# EAGLE design 8x8 LED Cathode Base V4 (EAGLE 6.1)
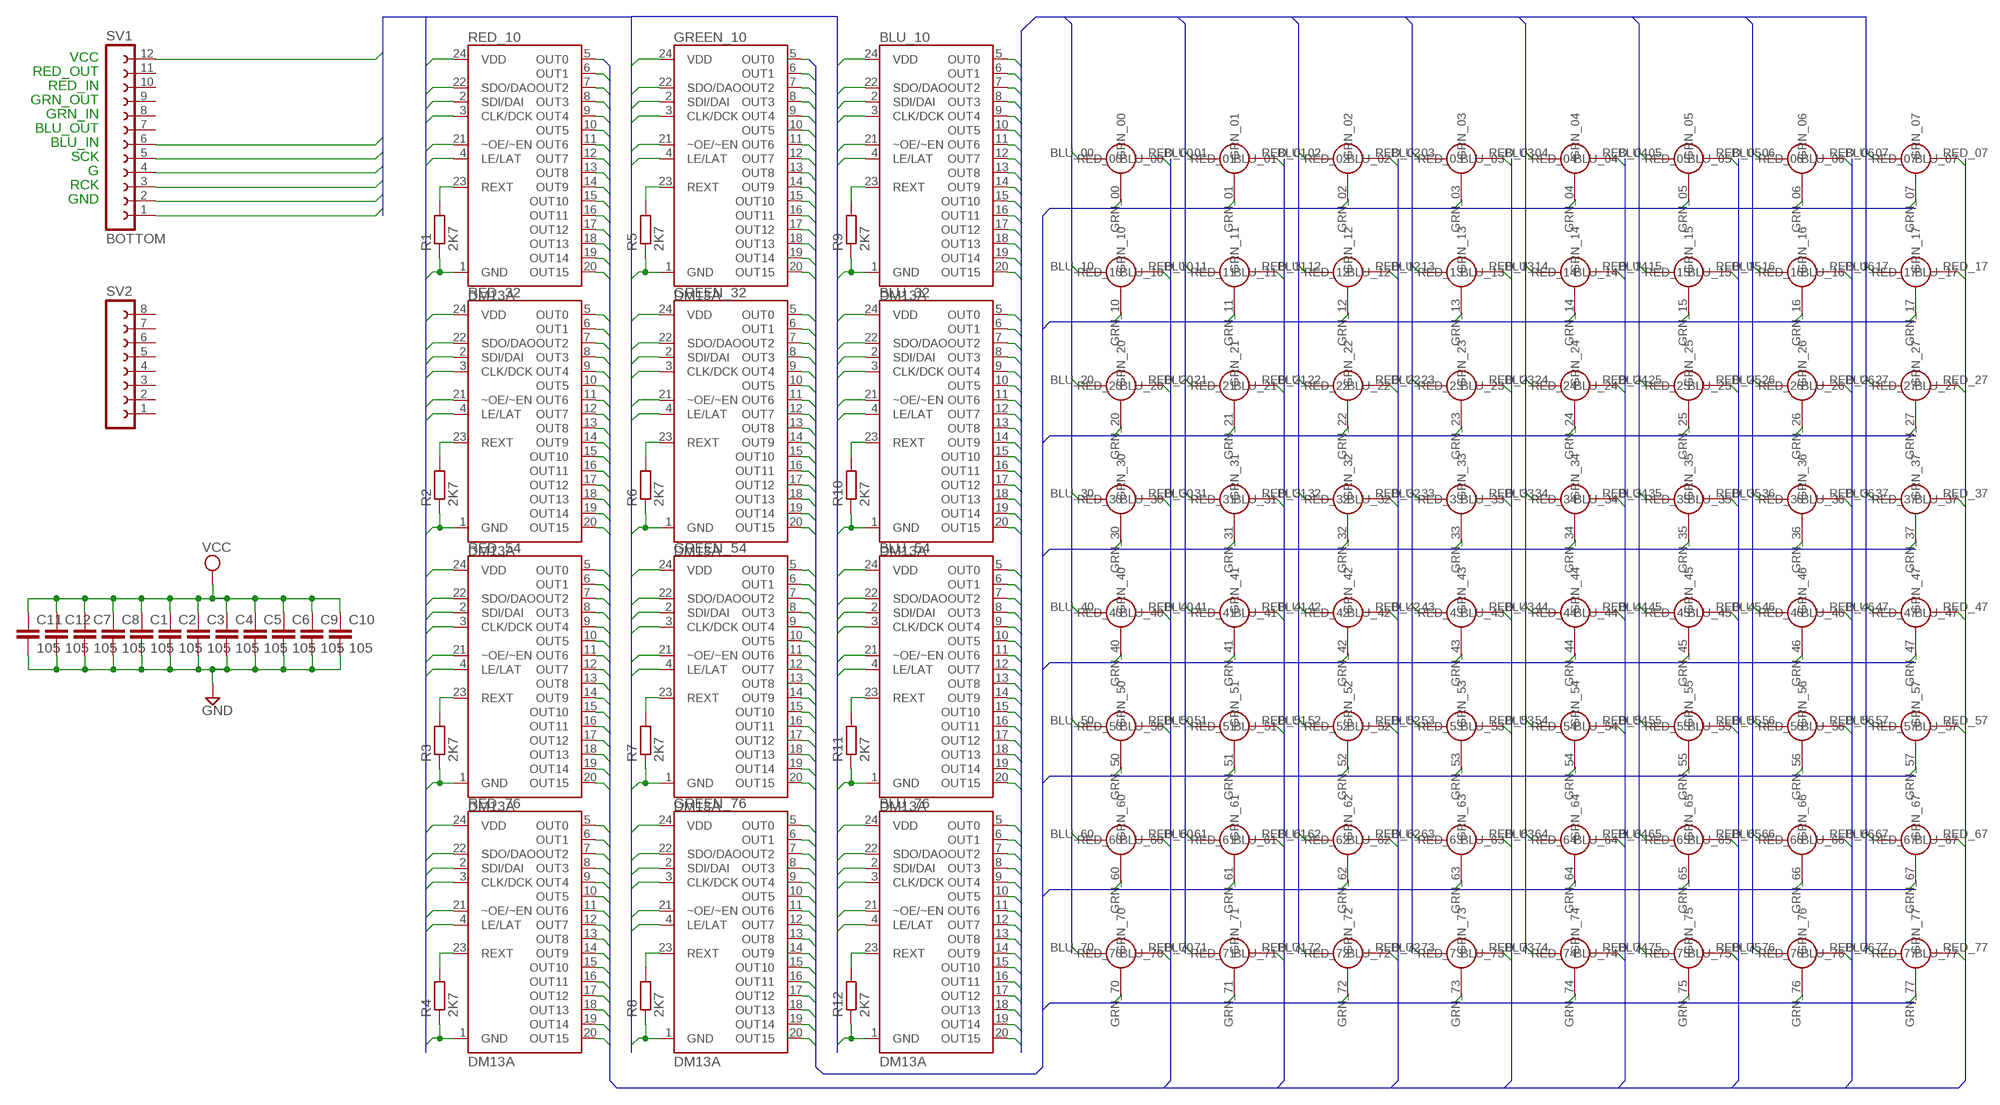
[diagram p0: schematic, sheet 1]

## Parts
BLU_10  DM13A  [DIL24-3]
BLU_32  DM13A  [DIL24-3]
BLU_54  DM13A  [DIL24-3]
BLU_76  DM13A  [DIL24-3]
C1  105  C-EUC1206  [C1206]
C2  105  C-EUC1206  [C1206]
C3  105  C-EUC1206  [C1206]
C4  105  C-EUC1206  [C1206]
C5  105  C-EUC1206  [C1206]
C6  105  C-EUC1206  [C1206]
C7  105  C-EUC1206  [C1206]
C8  105  C-EUC1206  [C1206]
C9  105  C-EUC1206  [C1206]
C10  105  C-EUC1206  [C1206]
C11  105  C-EUC1206  [C1206]
C12  105  C-EUC1206  [C1206]
GREEN_10  DM13A  [DIL24-3]
GREEN_32  DM13A  [DIL24-3]
GREEN_54  DM13A  [DIL24-3]
GREEN_76  DM13A  [DIL24-3]
R1  2K7  R-EU_R1206  [R1206]
R2  2K7  R-EU_R1206  [R1206]
R3  2K7  R-EU_R1206  [R1206]
R4  2K7  R-EU_R1206  [R1206]
R5  2K7  R-EU_R1206  [R1206]
R6  2K7  R-EU_R1206  [R1206]
R7  2K7  R-EU_R1206  [R1206]
R8  2K7  R-EU_R1206  [R1206]
R9  2K7  R-EU_R1206  [R1206]
R10  2K7  R-EU_R1206  [R1206]
R11  2K7  R-EU_R1206  [R1206]
R12  2K7  R-EU_R1206  [R1206]
RED_10  DM13A  [DIL24-3]
RED_32  DM13A  [DIL24-3]
RED_54  DM13A  [DIL24-3]
RED_76  DM13A  [DIL24-3]
SV1  BOTTOM  FE12-1  [FE12]
SV2  FE08-1  [FE08]
U$1  8X8_RGB_COLUMN  [8X8_RGB_LED_120]

## Nets
BLANK: BLU_10.21(~OE/~EN) BLU_32.21(~OE/~EN) BLU_54.21(~OE/~EN) BLU_76.21(~OE/~EN) GREEN_10.21(~OE/~EN) GREEN_32.21(~OE/~EN) GREEN_54.21(~OE/~EN) GREEN_76.21(~OE/~EN) RED_10.21(~OE/~EN) RED_32.21(~OE/~EN) RED_54.21(~OE/~EN) RED_76.21(~OE/~EN) SV1.4
BLU_00: BLU_10.5(OUT0) U$1.BLU_00
BLU_01: BLU_10.6(OUT1) U$1.BLU_01
BLU_02: BLU_10.7(OUT2) U$1.BLU_02
BLU_03: BLU_10.8(OUT3) U$1.BLU_03
BLU_04: BLU_10.9(OUT4) U$1.BLU_04
BLU_05: BLU_10.10(OUT5) U$1.BLU_05
BLU_06: BLU_10.11(OUT6) U$1.BLU_06
BLU_07: BLU_10.12(OUT7) U$1.BLU_07
BLU_10: BLU_10.13(OUT8) U$1.BLU_10
BLU_11: BLU_10.14(OUT9) U$1.BLU_11
BLU_12: BLU_10.15(OUT10) U$1.BLU_12
BLU_13: BLU_10.16(OUT11) U$1.BLU_13
BLU_14: BLU_10.17(OUT12) U$1.BLU_14
BLU_15: BLU_10.18(OUT13) U$1.BLU_15
BLU_16: BLU_10.19(OUT14) U$1.BLU_16
BLU_17: BLU_10.20(OUT15) U$1.BLU_17
BLU_20: BLU_32.5(OUT0) U$1.BLU_20
BLU_21: BLU_32.6(OUT1) U$1.BLU_21
BLU_22: BLU_32.7(OUT2) U$1.BLU_22
BLU_23: BLU_32.8(OUT3) U$1.BLU_23
BLU_24: BLU_32.9(OUT4) U$1.BLU_24
BLU_25: BLU_32.10(OUT5) U$1.BLU_25
BLU_26: BLU_32.11(OUT6) U$1.BLU_26
BLU_27: BLU_32.12(OUT7) U$1.BLU_27
BLU_30: BLU_32.13(OUT8) U$1.BLU_30
BLU_31: BLU_32.14(OUT9) U$1.BLU_31
BLU_32: BLU_32.15(OUT10) U$1.BLU_32
BLU_32_DATA: BLU_10.22(SDO/DAO) BLU_32.2(SDI/DAI)
BLU_33: BLU_32.16(OUT11) U$1.BLU_33
BLU_34: BLU_32.17(OUT12) U$1.BLU_34
BLU_35: BLU_32.18(OUT13) U$1.BLU_35
BLU_36: BLU_32.19(OUT14) U$1.BLU_36
BLU_37: BLU_32.20(OUT15) U$1.BLU_37
BLU_40: BLU_54.5(OUT0) U$1.BLU_40
BLU_41: BLU_54.6(OUT1) U$1.BLU_41
BLU_42: BLU_54.7(OUT2) U$1.BLU_42
BLU_43: BLU_54.8(OUT3) U$1.BLU_43
BLU_44: BLU_54.9(OUT4) U$1.BLU_44
BLU_45: BLU_54.10(OUT5) U$1.BLU_45
BLU_46: BLU_54.11(OUT6) U$1.BLU_46
BLU_47: BLU_54.12(OUT7) U$1.BLU_47
BLU_50: BLU_54.13(OUT8) U$1.BLU_50
BLU_51: BLU_54.14(OUT9) U$1.BLU_51
BLU_52: BLU_54.15(OUT10) U$1.BLU_52
BLU_53: BLU_54.16(OUT11) U$1.BLU_53
BLU_54: BLU_54.17(OUT12) U$1.BLU_54
BLU_54_DATA: BLU_32.22(SDO/DAO) BLU_54.2(SDI/DAI)
BLU_55: BLU_54.18(OUT13) U$1.BLU_55
BLU_56: BLU_54.19(OUT14) U$1.BLU_56
BLU_57: BLU_54.20(OUT15) U$1.BLU_57
BLU_60: BLU_76.5(OUT0) U$1.BLU_60
BLU_61: BLU_76.6(OUT1) U$1.BLU_61
BLU_62: BLU_76.7(OUT2) U$1.BLU_62
BLU_63: BLU_76.8(OUT3) U$1.BLU_63
BLU_64: BLU_76.9(OUT4) U$1.BLU_64
BLU_65: BLU_76.10(OUT5) U$1.BLU_65
BLU_66: BLU_76.11(OUT6) U$1.BLU_66
BLU_67: BLU_76.12(OUT7) U$1.BLU_67
BLU_70: BLU_76.13(OUT8) U$1.BLU_70
BLU_71: BLU_76.14(OUT9) U$1.BLU_71
BLU_72: BLU_76.15(OUT10) U$1.BLU_72
BLU_73: BLU_76.16(OUT11) U$1.BLU_73
BLU_74: BLU_76.17(OUT12) U$1.BLU_74
BLU_75: BLU_76.18(OUT13) U$1.BLU_75
BLU_76: BLU_76.19(OUT14) U$1.BLU_76
BLU_76_DATA: BLU_54.22(SDO/DAO) BLU_76.2(SDI/DAI)
BLU_77: BLU_76.20(OUT15) U$1.BLU_77
BLU_IN: BLU_10.2(SDI/DAI) SV1.6
BLU_OUT: BLU_76.22(SDO/DAO) GREEN_10.2(SDI/DAI)
CLOCK: BLU_10.3(CLK/DCK) BLU_32.3(CLK/DCK) BLU_54.3(CLK/DCK) BLU_76.3(CLK/DCK) GREEN_10.3(CLK/DCK) GREEN_32.3(CLK/DCK) GREEN_54.3(CLK/DCK) GREEN_76.3(CLK/DCK) RED_10.3(CLK/DCK) RED_32.3(CLK/DCK) RED_54.3(CLK/DCK) RED_76.3(CLK/DCK) SV1.5
GND: BLU_10.1(GND) BLU_32.1(GND) BLU_54.1(GND) BLU_76.1(GND) C1.2 C2.2 C3.2 C4.2 C5.2 C6.2 C7.2 C8.2 C9.2 C10.2 C11.2 C12.2 GREEN_10.1(GND) GREEN_32.1(GND) GREEN_54.1(GND) GREEN_76.1(GND) R1.1 R2.1 R3.1 R4.1 R5.1 R6.1 R7.1 R8.1 R9.1 R10.1 R11.1 R12.1 RED_10.1(GND) RED_32.1(GND) RED_54.1(GND) RED_76.1(GND) SV1.1 SV1.2
GRN_00: GREEN_10.5(OUT0) U$1.GRN_00
GRN_01: GREEN_10.6(OUT1) U$1.GRN_01
GRN_02: GREEN_10.7(OUT2) U$1.GRN_02
GRN_03: GREEN_10.8(OUT3) U$1.GRN_03
GRN_04: GREEN_10.9(OUT4) U$1.GRN_04
GRN_05: GREEN_10.10(OUT5) U$1.GRN_05
GRN_06: GREEN_10.11(OUT6) U$1.GRN_06
GRN_07: GREEN_10.12(OUT7) U$1.GRN_07
GRN_10: GREEN_10.13(OUT8) U$1.GRN_10
GRN_11: GREEN_10.14(OUT9) U$1.GRN_11
GRN_12: GREEN_10.15(OUT10) U$1.GRN_12
GRN_13: GREEN_10.16(OUT11) U$1.GRN_13
GRN_14: GREEN_10.17(OUT12) U$1.GRN_14
GRN_15: GREEN_10.18(OUT13) U$1.GRN_15
GRN_16: GREEN_10.19(OUT14) U$1.GRN_16
GRN_17: GREEN_10.20(OUT15) U$1.GRN_17
GRN_20: GREEN_32.5(OUT0) U$1.GRN_20
GRN_21: GREEN_32.6(OUT1) U$1.GRN_21
GRN_22: GREEN_32.7(OUT2) U$1.GRN_22
GRN_23: GREEN_32.8(OUT3) U$1.GRN_23
GRN_24: GREEN_32.9(OUT4) U$1.GRN_24
GRN_25: GREEN_32.10(OUT5) U$1.GRN_25
GRN_26: GREEN_32.11(OUT6) U$1.GRN_26
GRN_27: GREEN_32.12(OUT7) U$1.GRN_27
GRN_30: GREEN_32.13(OUT8) U$1.GRN_30
GRN_31: GREEN_32.14(OUT9) U$1.GRN_31
GRN_32: GREEN_32.15(OUT10) U$1.GRN_32
GRN_32_DATA: GREEN_10.22(SDO/DAO) GREEN_32.2(SDI/DAI)
GRN_33: GREEN_32.16(OUT11) U$1.GRN_33
GRN_34: GREEN_32.17(OUT12) U$1.GRN_34
GRN_35: GREEN_32.18(OUT13) U$1.GRN_35
GRN_36: GREEN_32.19(OUT14) U$1.GRN_36
GRN_37: GREEN_32.20(OUT15) U$1.GRN_37
GRN_40: GREEN_54.5(OUT0) U$1.GRN_40
GRN_41: GREEN_54.6(OUT1) U$1.GRN_41
GRN_42: GREEN_54.7(OUT2) U$1.GRN_42
GRN_43: GREEN_54.8(OUT3) U$1.GRN_43
GRN_44: GREEN_54.9(OUT4) U$1.GRN_44
GRN_45: GREEN_54.10(OUT5) U$1.GRN_45
GRN_46: GREEN_54.11(OUT6) U$1.GRN_46
GRN_47: GREEN_54.12(OUT7) U$1.GRN_47
GRN_50: GREEN_54.13(OUT8) U$1.GRN_50
GRN_51: GREEN_54.14(OUT9) U$1.GRN_51
GRN_52: GREEN_54.15(OUT10) U$1.GRN_52
GRN_53: GREEN_54.16(OUT11) U$1.GRN_53
GRN_54: GREEN_54.17(OUT12) U$1.GRN_54
GRN_54_DATA: GREEN_32.22(SDO/DAO) GREEN_54.2(SDI/DAI)
GRN_55: GREEN_54.18(OUT13) U$1.GRN_55
GRN_56: GREEN_54.19(OUT14) U$1.GRN_56
GRN_57: GREEN_54.20(OUT15) U$1.GRN_57
GRN_60: GREEN_76.5(OUT0) U$1.GRN_60
GRN_61: GREEN_76.6(OUT1) U$1.GRN_61
GRN_62: GREEN_76.7(OUT2) U$1.GRN_62
GRN_63: GREEN_76.8(OUT3) U$1.GRN_63
GRN_64: GREEN_76.9(OUT4) U$1.GRN_64
GRN_65: GREEN_76.10(OUT5) U$1.GRN_65
GRN_66: GREEN_76.11(OUT6) U$1.GRN_66
GRN_67: GREEN_76.12(OUT7) U$1.GRN_67
GRN_70: GREEN_76.13(OUT8) U$1.GRN_70
GRN_71: GREEN_76.14(OUT9) U$1.GRN_71
GRN_72: GREEN_76.15(OUT10) U$1.GRN_72
GRN_73: GREEN_76.16(OUT11) U$1.GRN_73
GRN_74: GREEN_76.17(OUT12) U$1.GRN_74
GRN_75: GREEN_76.18(OUT13) U$1.GRN_75
GRN_76: GREEN_76.19(OUT14) U$1.GRN_76
GRN_76_DATA: GREEN_54.22(SDO/DAO) GREEN_76.2(SDI/DAI)
GRN_77: GREEN_76.20(OUT15) U$1.GRN_77
GRN_OUT: GREEN_76.22(SDO/DAO) RED_10.2(SDI/DAI)
LATCH: BLU_10.4(LE/LAT) BLU_32.4(LE/LAT) BLU_54.4(LE/LAT) BLU_76.4(LE/LAT) GREEN_10.4(LE/LAT) GREEN_32.4(LE/LAT) GREEN_54.4(LE/LAT) GREEN_76.4(LE/LAT) RED_10.4(LE/LAT) RED_32.4(LE/LAT) RED_54.4(LE/LAT) RED_76.4(LE/LAT) SV1.3
N$1: GREEN_10.23(REXT) R5.2
N$3: GREEN_32.23(REXT) R6.2
N$4: GREEN_54.23(REXT) R7.2
N$5: GREEN_76.23(REXT) R8.2
N$6: BLU_10.23(REXT) R9.2
N$7: BLU_32.23(REXT) R10.2
N$8: BLU_54.23(REXT) R11.2
N$9: BLU_76.23(REXT) R12.2
N$13: R1.2 RED_10.23(REXT)
N$14: R2.2 RED_32.23(REXT)
N$15: R3.2 RED_54.23(REXT)
N$18: R4.2 RED_76.23(REXT)
RED_00: RED_10.5(OUT0) U$1.RED_00
RED_01: RED_10.6(OUT1) U$1.RED_01
RED_02: RED_10.7(OUT2) U$1.RED_02
RED_03: RED_10.8(OUT3) U$1.RED_03
RED_04: RED_10.9(OUT4) U$1.RED_04
RED_05: RED_10.10(OUT5) U$1.RED_05
RED_06: RED_10.11(OUT6) U$1.RED_06
RED_07: RED_10.12(OUT7) U$1.RED_07
RED_10: RED_10.13(OUT8) U$1.RED_10
RED_11: RED_10.14(OUT9) U$1.RED_11
RED_12: RED_10.15(OUT10) U$1.RED_12
RED_13: RED_10.16(OUT11) U$1.RED_13
RED_14: RED_10.17(OUT12) U$1.RED_14
RED_15: RED_10.18(OUT13) U$1.RED_15
RED_16: RED_10.19(OUT14) U$1.RED_16
RED_17: RED_10.20(OUT15) U$1.RED_17
RED_20: RED_32.5(OUT0) U$1.RED_20
RED_21: RED_32.6(OUT1) U$1.RED_21
RED_22: RED_32.7(OUT2) U$1.RED_22
RED_23: RED_32.8(OUT3) U$1.RED_23
RED_24: RED_32.9(OUT4) U$1.RED_24
RED_25: RED_32.10(OUT5) U$1.RED_25
RED_26: RED_32.11(OUT6) U$1.RED_26
RED_27: RED_32.12(OUT7) U$1.RED_27
RED_30: RED_32.13(OUT8) U$1.RED_30
RED_31: RED_32.14(OUT9) U$1.RED_31
RED_32: RED_32.15(OUT10) U$1.RED_32
RED_32_DATA: RED_10.22(SDO/DAO) RED_32.2(SDI/DAI)
RED_33: RED_32.16(OUT11) U$1.RED_33
RED_34: RED_32.17(OUT12) U$1.RED_34
RED_35: RED_32.18(OUT13) U$1.RED_35
RED_36: RED_32.19(OUT14) U$1.RED_36
RED_37: RED_32.20(OUT15) U$1.RED_37
RED_40: RED_54.5(OUT0) U$1.RED_40
RED_41: RED_54.6(OUT1) U$1.RED_41
RED_42: RED_54.7(OUT2) U$1.RED_42
RED_43: RED_54.8(OUT3) U$1.RED_43
RED_44: RED_54.9(OUT4) U$1.RED_44
RED_45: RED_54.10(OUT5) U$1.RED_45
RED_46: RED_54.11(OUT6) U$1.RED_46
RED_47: RED_54.12(OUT7) U$1.RED_47
RED_50: RED_54.13(OUT8) U$1.RED_50
RED_51: RED_54.14(OUT9) U$1.RED_51
RED_52: RED_54.15(OUT10) U$1.RED_52
RED_53: RED_54.16(OUT11) U$1.RED_53
RED_54: RED_54.17(OUT12) U$1.RED_54
RED_54_DATA: RED_32.22(SDO/DAO) RED_54.2(SDI/DAI)
RED_55: RED_54.18(OUT13) U$1.RED_55
RED_56: RED_54.19(OUT14) U$1.RED_56
RED_57: RED_54.20(OUT15) U$1.RED_57
RED_60: RED_76.5(OUT0) U$1.RED_60
RED_61: RED_76.6(OUT1) U$1.RED_61
RED_62: RED_76.7(OUT2) U$1.RED_62
RED_63: RED_76.8(OUT3) U$1.RED_63
RED_64: RED_76.9(OUT4) U$1.RED_64
RED_65: RED_76.10(OUT5) U$1.RED_65
RED_66: RED_76.11(OUT6) U$1.RED_66
RED_67: RED_76.12(OUT7) U$1.RED_67
RED_70: RED_76.13(OUT8) U$1.RED_70
RED_71: RED_76.14(OUT9) U$1.RED_71
RED_72: RED_76.15(OUT10) U$1.RED_72
RED_73: RED_76.16(OUT11) U$1.RED_73
RED_74: RED_76.17(OUT12) U$1.RED_74
RED_75: RED_76.18(OUT13) U$1.RED_75
RED_76: RED_76.19(OUT14) U$1.RED_76
RED_76_DATA: RED_54.22(SDO/DAO) RED_76.2(SDI/DAI)
RED_77: RED_76.20(OUT15) U$1.RED_77
RED_OUT: RED_76.22(SDO/DAO)
VCC: BLU_10.24(VDD) BLU_32.24(VDD) BLU_54.24(VDD) BLU_76.24(VDD) C1.1 C2.1 C3.1 C4.1 C5.1 C6.1 C7.1 C8.1 C9.1 C10.1 C11.1 C12.1 GREEN_10.24(VDD) GREEN_32.24(VDD) GREEN_54.24(VDD) GREEN_76.24(VDD) RED_10.24(VDD) RED_32.24(VDD) RED_54.24(VDD) RED_76.24(VDD) SV1.12
Unconnected: SV1.7 SV1.8 SV1.9 SV1.10 SV1.11 SV2.1 SV2.2 SV2.3 SV2.4 SV2.5 SV2.6 SV2.7 SV2.8

## Buses
RED
B$8
GREEN
BLUE

## Notes on the sheet
- VCC
- RED_OUT
- RED_IN
- GRN_OUT
- GRN_IN
- BLU_OUT
- BLU_IN
- SCK
- G
- RCK
- GND

## Library data of the parts
BLU_10 BLU_32 BLU_54 BLU_76 GREEN_10 GREEN_32 GREEN_54 GREEN_76 RED_10 RED_32 RED_54 RED_76 = 8x8x8_cube:DM13A: 16-Channel, Constant-Current LED Driver
C1-C12 = rcl:C-EU: CAPACITOR, European symbol
R1-R12 = resistor:R-EU_: RESISTOR, European symbol
SV1 = con-lsta:FE12-1: FEMALE HEADER; OC_FARNELL: unknown; OC_NEWARK: unknown
SV2 = con-lsta:FE08-1: FEMALE HEADER; OC_FARNELL: unknown; OC_NEWARK: unknown
U$1 = 8x8x8_cube:8X8_RGB_COLUMN: 8x8x8 RGB Cube Base Layout

## Board
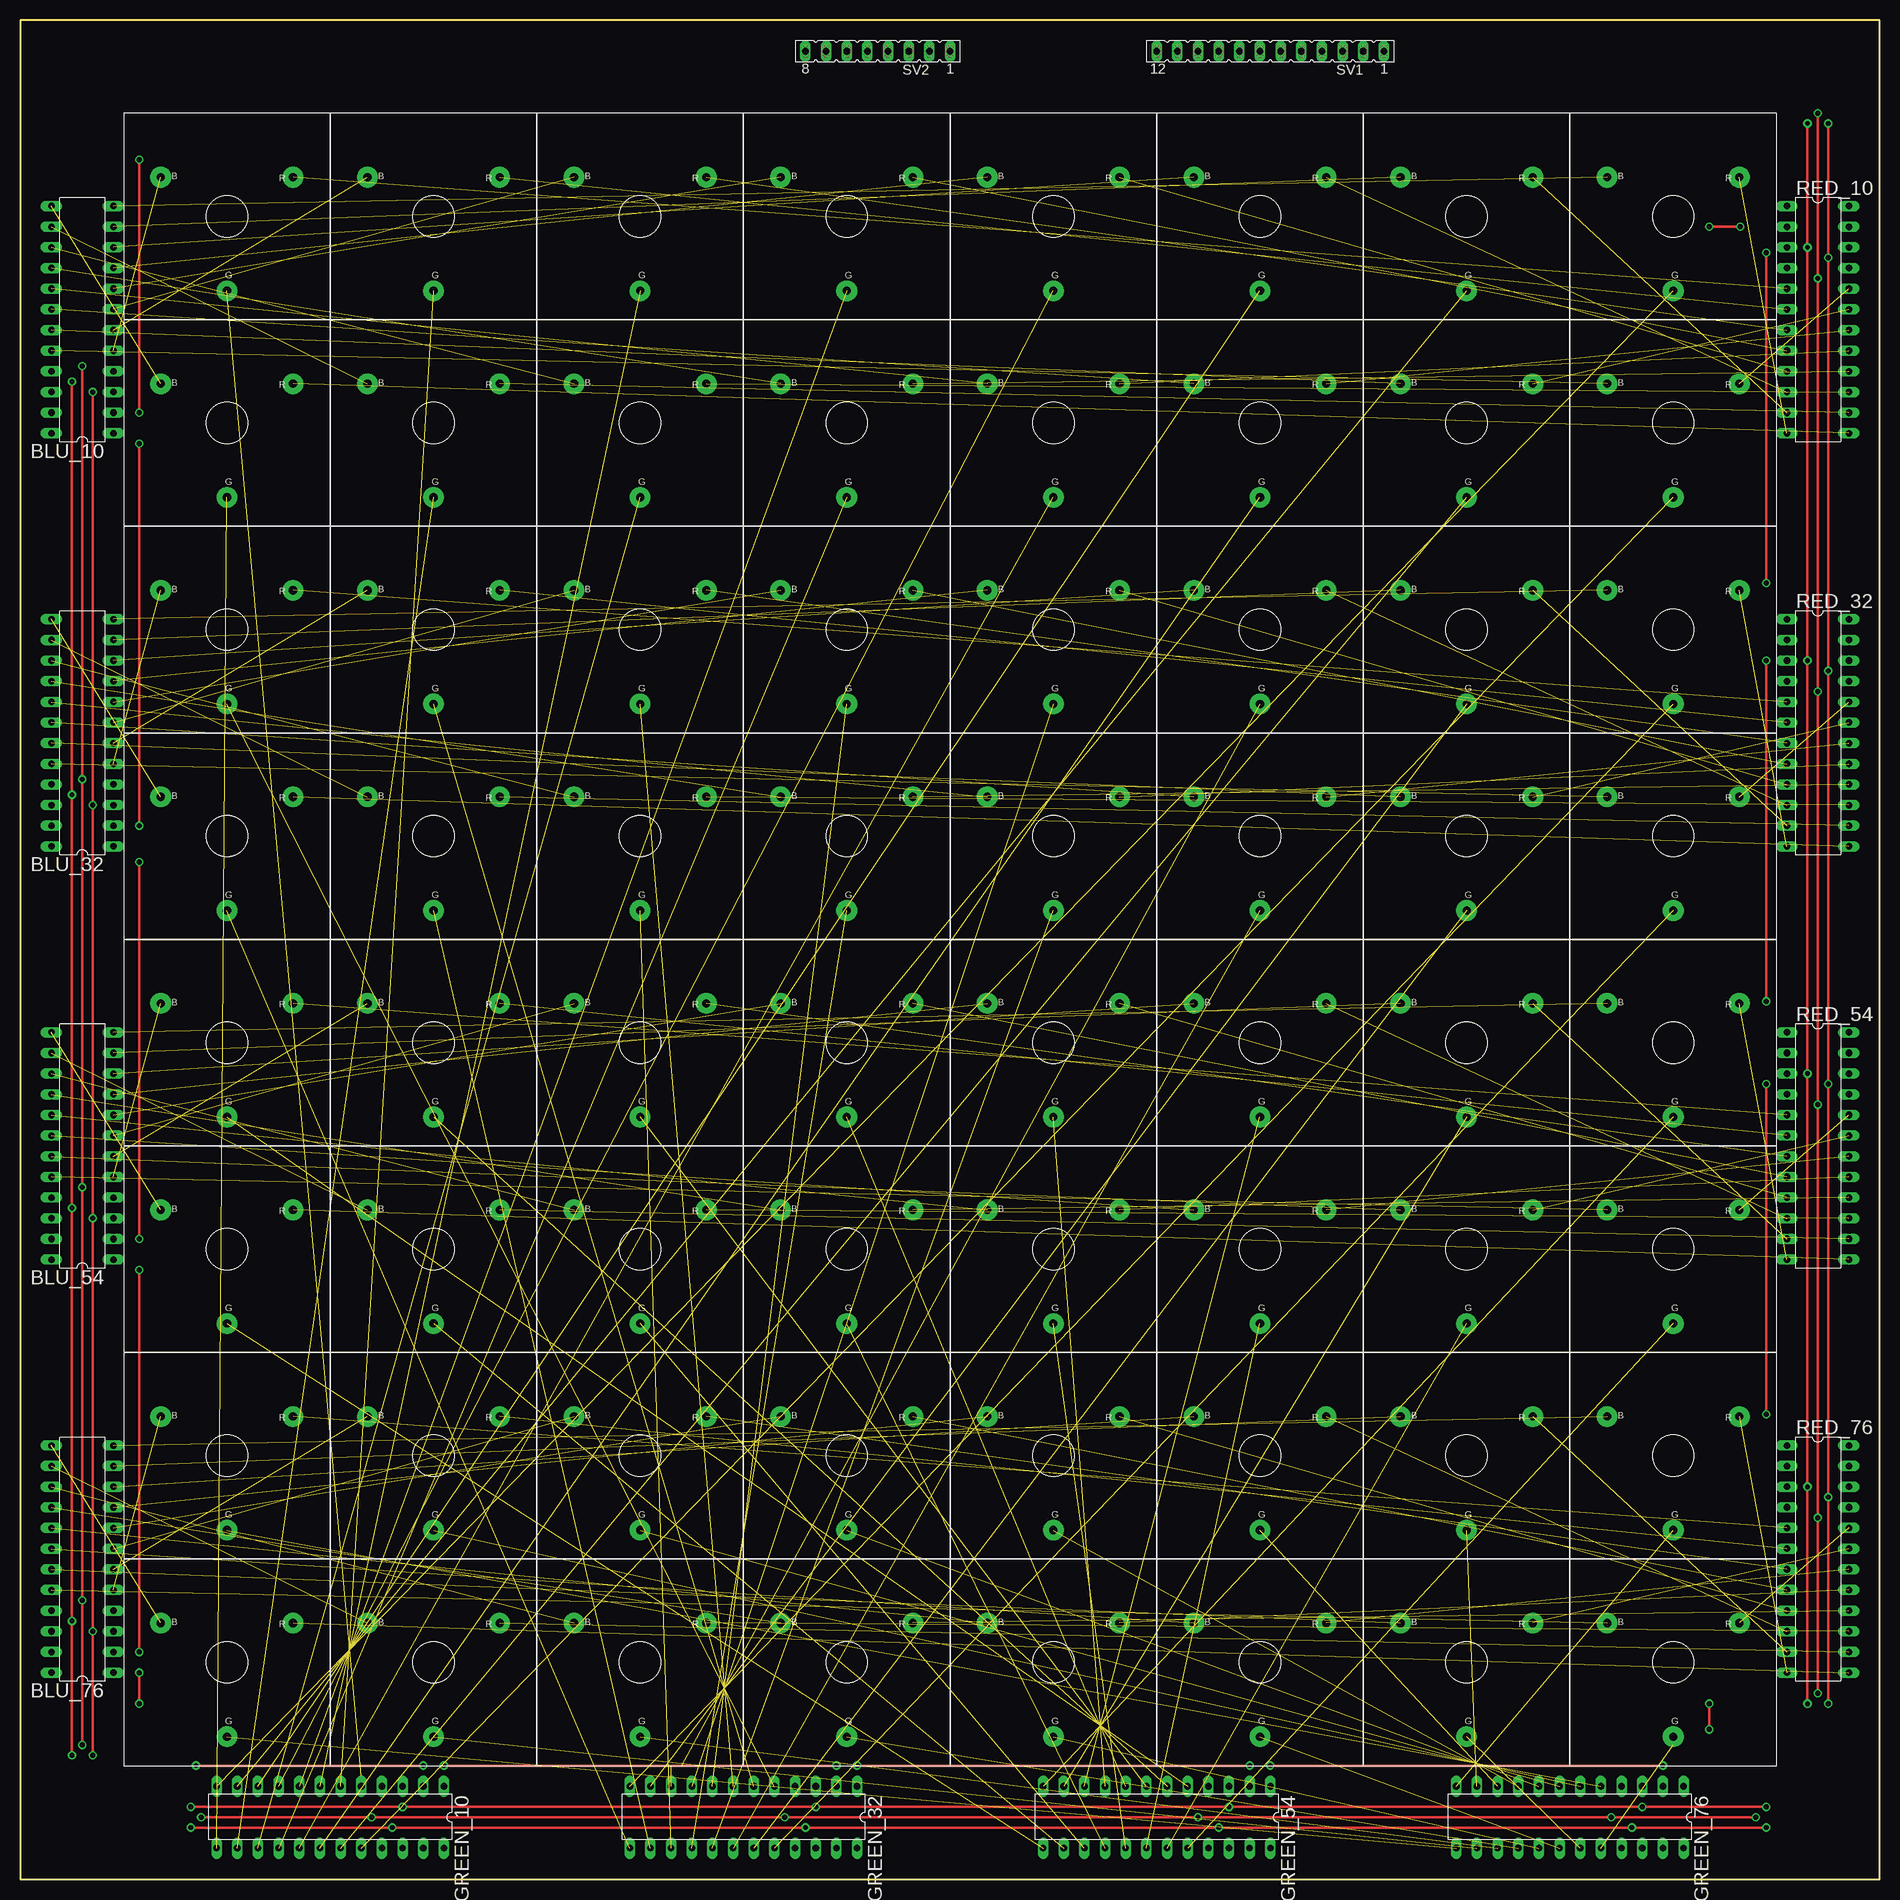
[diagram p1: board, top side]
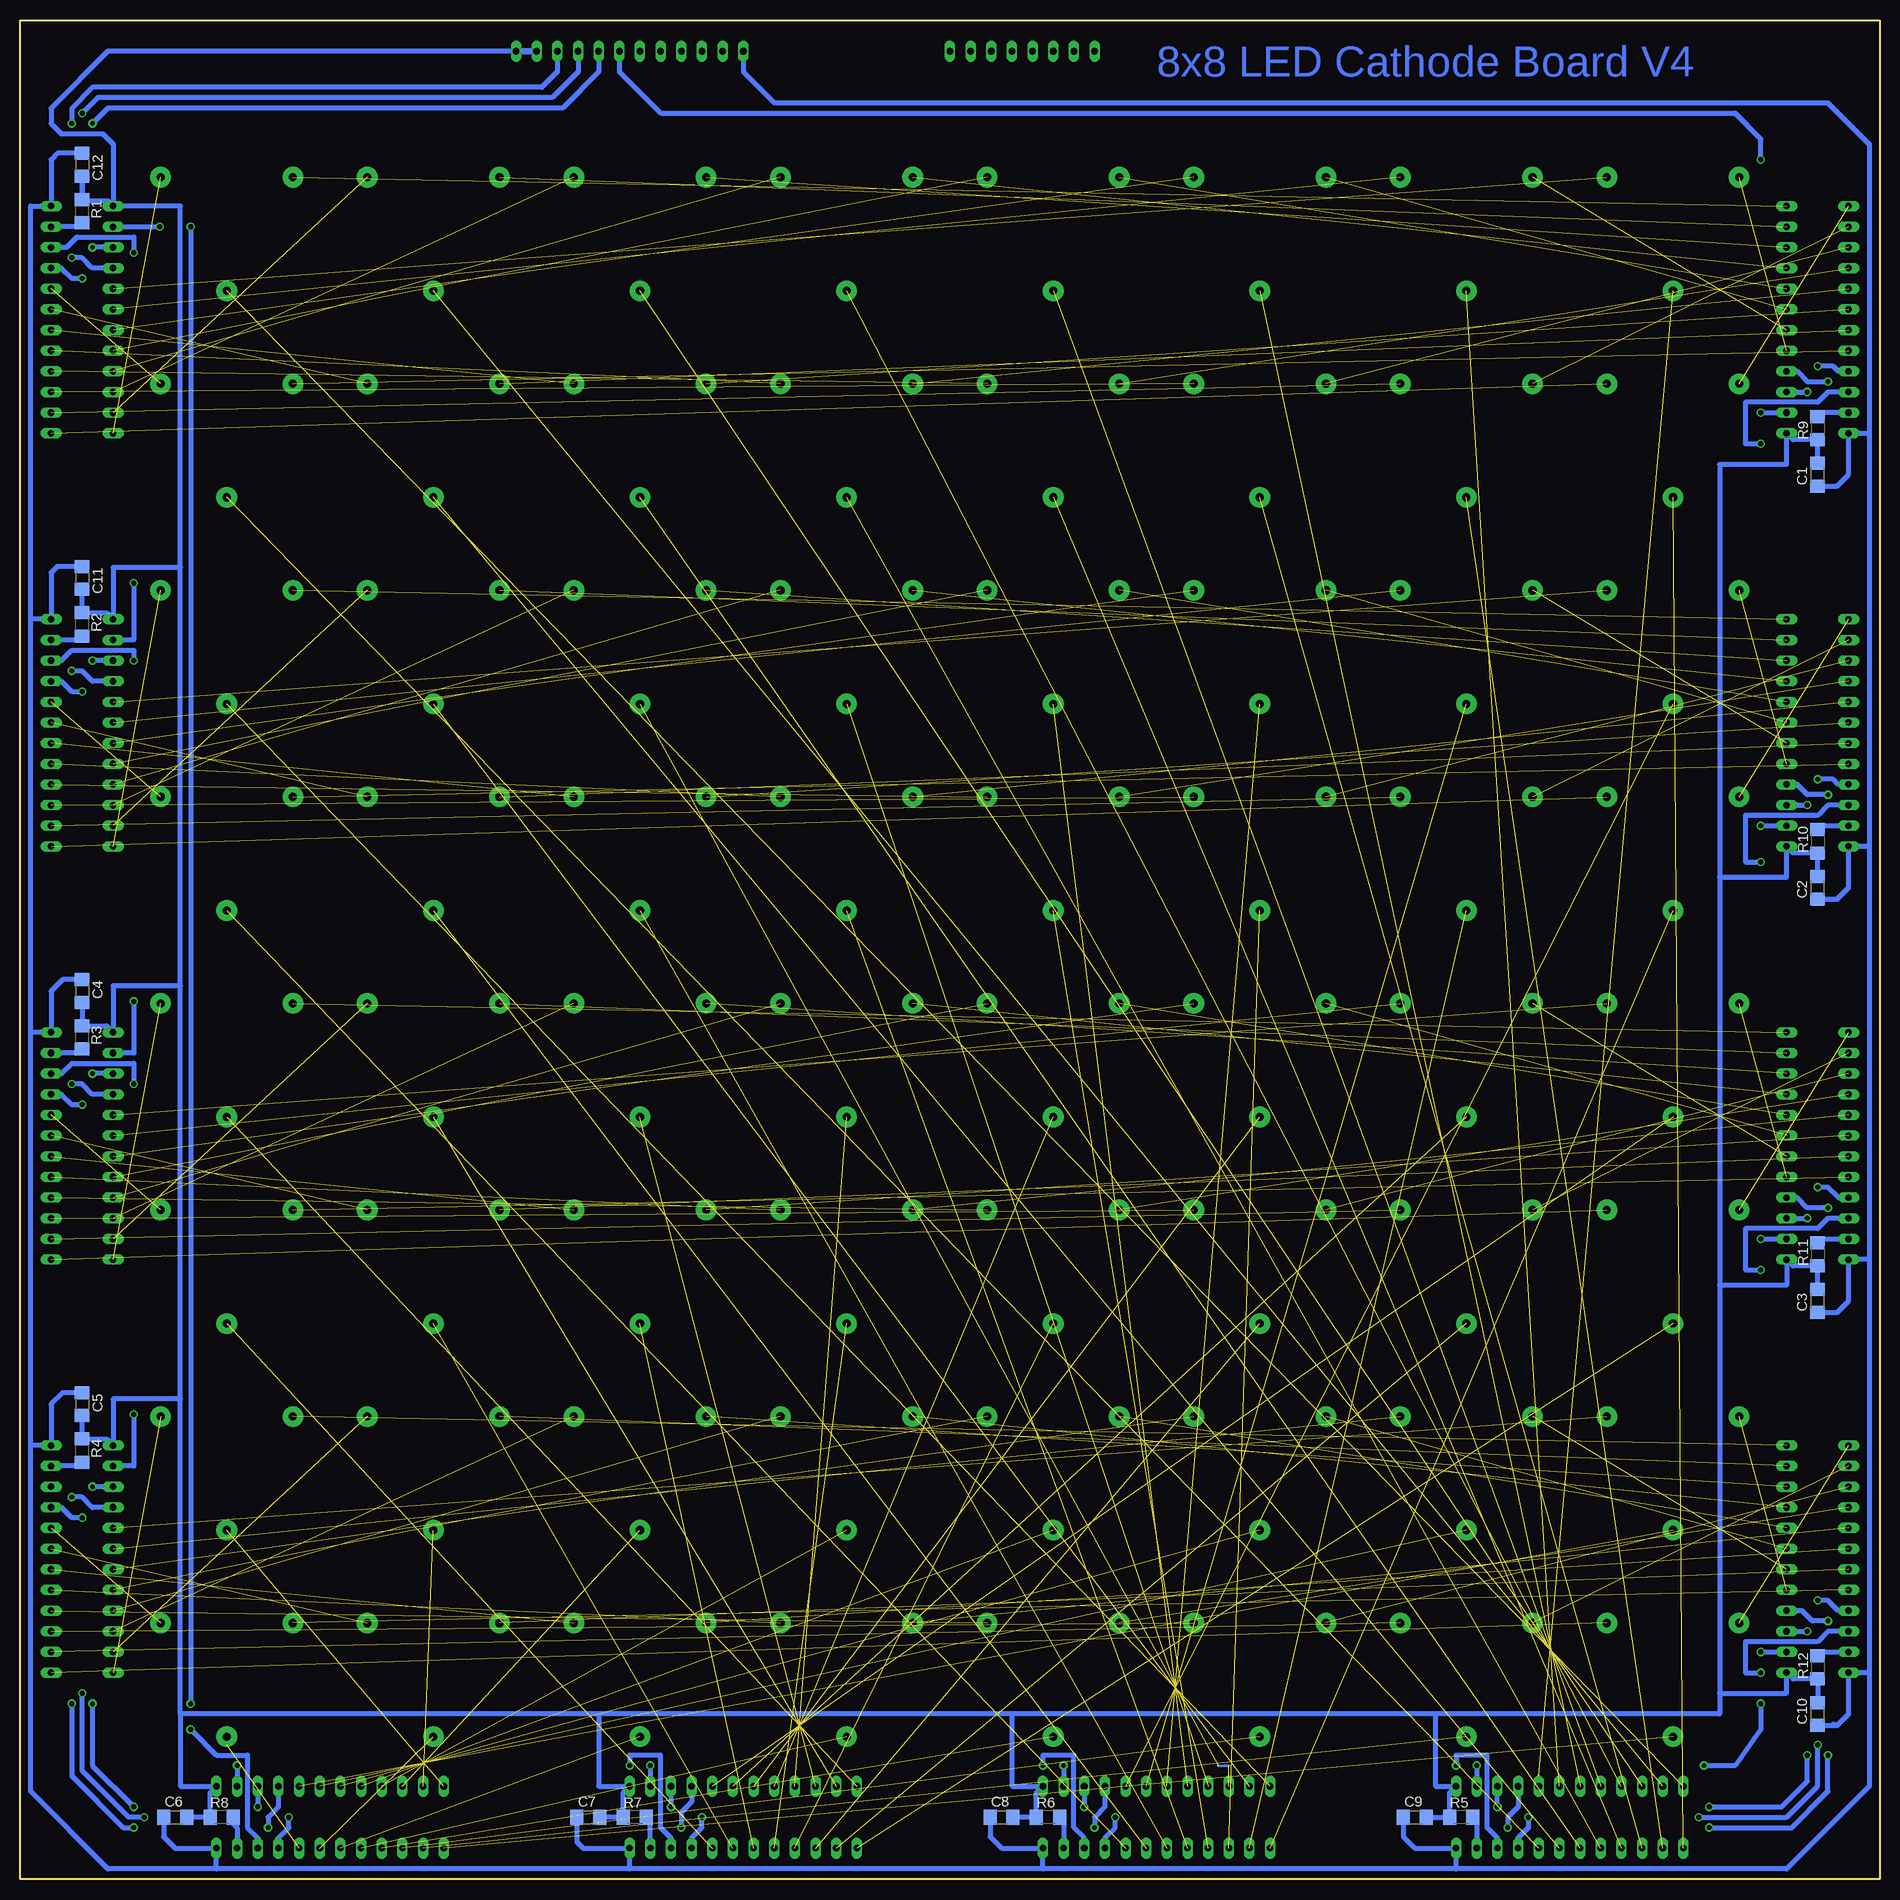
[diagram p2: board, bottom side, seen from below]

Size 228.58 x 228.58 mm. Coordinates in mm from the lower left corner, seen from the top.
Outline: 0,0 228.58,0 228.58,228.59 0,228.59 0,0
Copper layers (1*16): Top 0.035mm / dielectric 1.5mm / Bottom 0.035mm
Design rules: minimum track width 12mil, minimum drill 24mil, track to track 8mil, track to pad 8mil, pad to pad 8mil, via to via 8mil, smd to smd 8mil, copper to edge 40mil, drill to drill 8mil, minimum pad ring 10mil, minimum via ring 8mil, stop-mask expansion 4mil, vias tented up to drill 0mil, thermal gap 10mil

### Footprints (pad centres in the part's own frame; a part is rotated, then mirrored left to right if it is on the bottom)
DIL24-3 = drill 0.813 long: 1 -13.97,-3.81; 2 -11.43,-3.81; 3 -8.89,-3.81; 4 -6.35,-3.81; 5 -3.81,-3.81; 6 -1.27,-3.81; 7 1.27,-3.81; 8 3.81,-3.81; 9 6.35,-3.81; 10 8.89,-3.81; 11 11.43,-3.81; 12 13.97,-3.81; 13 13.97,3.81; 14 11.43,3.81; 15 8.89,3.81; 16 6.35,3.81; 17 3.81,3.81; 18 1.27,3.81; 19 -1.27,3.81; 20 -3.81,3.81; 21 -6.35,3.81; 22 -8.89,3.81; 23 -11.43,3.81; 24 -13.97,3.81
C1206 = smd 1.6 x 1.8: 1 -1.4,0; 2 1.4,0
R1206 = smd 1.6 x 1.803: 1 -1.422,0; 2 1.422,0
FE12 = drill 0.813 long: 1 -13.97,0; 2 -11.43,0; 3 -8.89,0; 4 -6.35,0; 5 -3.81,0; 6 -1.27,0; 7 1.27,0; 8 3.81,0; 9 6.35,0; 10 8.89,0; 11 11.43,0; 12 13.97,0
FE08 = drill 0.813 long: 1 -8.89,0; 2 -6.35,0; 3 -3.81,0; 4 -1.27,0; 5 1.27,0; 6 3.81,0; 7 6.35,0; 8 8.89,0
8X8_RGB_LED_120 = drill 1 pad 2.54: BLU_00 -97.028,93.726; BLU_01 -71.628,93.726; BLU_02 -46.228,93.726; BLU_03 -20.828,93.726; BLU_04 4.572,93.726; BLU_05 29.972,93.726; BLU_06 55.372,93.726; BLU_07 80.772,93.726; BLU_10 -97.028,68.326; BLU_11 -71.628,68.326; BLU_12 -46.228,68.326; BLU_13 -20.828,68.326; BLU_14 4.572,68.326; BLU_15 29.972,68.326; BLU_16 55.372,68.326; BLU_17 80.772,68.326; BLU_20 -97.028,42.926; BLU_21 -71.628,42.926; BLU_22 -46.228,42.926; BLU_23 -20.828,42.926; BLU_24 4.572,42.926; BLU_25 29.972,42.926; BLU_26 55.372,42.926; BLU_27 80.772,42.926; BLU_30 -97.028,17.526; BLU_31 -71.628,17.526; BLU_32 -46.228,17.526; BLU_33 -20.828,17.526; BLU_34 4.572,17.526; BLU_35 29.972,17.526; BLU_36 55.372,17.526; BLU_37 80.772,17.526; BLU_40 -97.028,-7.874; BLU_41 -71.628,-7.874; BLU_42 -46.228,-7.874; BLU_43 -20.828,-7.874; BLU_44 4.572,-7.874; BLU_45 29.972,-7.874; BLU_46 55.372,-7.874; BLU_47 80.772,-7.874; BLU_50 -97.028,-33.274; BLU_51 -71.628,-33.274; BLU_52 -46.228,-33.274; BLU_53 -20.828,-33.274; BLU_54 4.572,-33.274; BLU_55 29.972,-33.274; BLU_56 55.372,-33.274; BLU_57 80.772,-33.274; BLU_60 -97.028,-58.674; BLU_61 -71.628,-58.674; BLU_62 -46.228,-58.674; BLU_63 -20.828,-58.674; BLU_64 4.572,-58.674; BLU_65 29.972,-58.674; BLU_66 55.372,-58.674; BLU_67 80.772,-58.674; BLU_70 -97.028,-84.074; BLU_71 -71.628,-84.074; BLU_72 -46.228,-84.074; BLU_73 -20.828,-84.074; BLU_74 4.572,-84.074; BLU_75 29.972,-84.074; BLU_76 55.372,-84.074; BLU_77 80.772,-84.074; GRN_00 -88.9,79.756; GRN_01 -63.5,79.756; GRN_02 -38.1,79.756; GRN_03 -12.7,79.756; GRN_04 12.7,79.756; GRN_05 38.1,79.756; GRN_06 63.5,79.756; GRN_07 88.9,79.756; GRN_10 -88.9,54.356; GRN_11 -63.5,54.356; GRN_12 -38.1,54.356; GRN_13 -12.7,54.356; GRN_14 12.7,54.356; GRN_15 38.1,54.356; GRN_16 63.5,54.356; GRN_17 88.9,54.356; GRN_20 -88.9,28.956; GRN_21 -63.5,28.956; GRN_22 -38.1,28.956; GRN_23 -12.7,28.956; GRN_24 12.7,28.956; GRN_25 38.1,28.956; GRN_26 63.5,28.956; GRN_27 88.9,28.956; GRN_30 -88.9,3.556; GRN_31 -63.5,3.556; GRN_32 -38.1,3.556; GRN_33 -12.7,3.556; GRN_34 12.7,3.556; GRN_35 38.1,3.556; GRN_36 63.5,3.556; GRN_37 88.9,3.556; GRN_40 -88.9,-21.844; GRN_41 -63.5,-21.844; GRN_42 -38.1,-21.844; GRN_43 -12.7,-21.844; GRN_44 12.7,-21.844; GRN_45 38.1,-21.844; GRN_46 63.5,-21.844; GRN_47 88.9,-21.844; GRN_50 -88.9,-47.244; GRN_51 -63.5,-47.244; GRN_52 -38.1,-47.244; GRN_53 -12.7,-47.244; GRN_54 12.7,-47.244; GRN_55 38.1,-47.244; GRN_56 63.5,-47.244; GRN_57 88.9,-47.244; GRN_60 -88.9,-72.644; GRN_61 -63.5,-72.644; GRN_62 -38.1,-72.644; GRN_63 -12.7,-72.644; GRN_64 12.7,-72.644; GRN_65 38.1,-72.644; GRN_66 63.5,-72.644; GRN_67 88.9,-72.644; GRN_70 -88.9,-98.044; GRN_71 -63.5,-98.044; GRN_72 -38.1,-98.044; GRN_73 -12.7,-98.044; GRN_74 12.7,-98.044; GRN_75 38.1,-98.044; GRN_76 63.5,-98.044; GRN_77 88.9,-98.044; RED_00 -80.772,93.726; RED_01 -55.372,93.726; RED_02 -29.972,93.726; RED_03 -4.572,93.726; RED_04 20.828,93.726; RED_05 46.228,93.726; RED_06 71.628,93.726; RED_07 97.028,93.726; RED_10 -80.772,68.326; RED_11 -55.372,68.326; RED_12 -29.972,68.326; RED_13 -4.572,68.326; RED_14 20.828,68.326; RED_15 46.228,68.326; RED_16 71.628,68.326; RED_17 97.028,68.326; RED_20 -80.772,42.926; RED_21 -55.372,42.926; RED_22 -29.972,42.926; RED_23 -4.572,42.926; RED_24 20.828,42.926; RED_25 46.228,42.926; RED_26 71.628,42.926; RED_27 97.028,42.926; RED_30 -80.772,17.526; RED_31 -55.372,17.526; RED_32 -29.972,17.526; RED_33 -4.572,17.526; RED_34 20.828,17.526; RED_35 46.228,17.526; RED_36 71.628,17.526; RED_37 97.028,17.526; RED_40 -80.772,-7.874; RED_41 -55.372,-7.874; RED_42 -29.972,-7.874; RED_43 -4.572,-7.874; RED_44 20.828,-7.874; RED_45 46.228,-7.874; RED_46 71.628,-7.874; RED_47 97.028,-7.874; RED_50 -80.772,-33.274; RED_51 -55.372,-33.274; RED_52 -29.972,-33.274; RED_53 -4.572,-33.274; RED_54 20.828,-33.274; RED_55 46.228,-33.274; RED_56 71.628,-33.274; RED_57 97.028,-33.274; RED_60 -80.772,-58.674; RED_61 -55.372,-58.674; RED_62 -29.972,-58.674; RED_63 -4.572,-58.674; RED_64 20.828,-58.674; RED_65 46.228,-58.674; RED_66 71.628,-58.674; RED_67 97.028,-58.674; RED_70 -80.772,-84.074; RED_71 -55.372,-84.074; RED_72 -29.972,-84.074; RED_73 -4.572,-84.074; RED_74 20.828,-84.074; RED_75 46.228,-84.074; RED_76 71.628,-84.074; RED_77 97.028,-84.074

### Placement (x,y rotation side)
BLU_10  7.62,191.77 90 top
BLU_32  7.62,140.97 90 top
BLU_54  7.62,90.17 90 top
BLU_76  7.62,39.37 90 top
C1  7.62,172.72 90 bottom
C2  7.62,121.92 90 bottom
C3  7.62,71.12 90 bottom
C4  220.98,109.22 270 bottom
C5  220.98,58.42 270 bottom
C6  209.55,7.62 0 bottom
C7  158.75,7.62 0 bottom
C8  107.95,7.62 0 bottom
C9  57.15,7.62 0 bottom
C10  7.62,20.32 90 bottom
C11  220.98,160.02 270 bottom
C12  220.98,210.82 270 bottom
GREEN_10  38.1,7.62 180 top
GREEN_32  88.9,7.62 180 top
GREEN_54  139.7,7.62 180 top
GREEN_76  190.5,7.62 180 top
R1  220.98,205.1 270 bottom
R2  220.98,154.31 270 bottom
R3  220.98,103.5 270 bottom
R4  220.98,52.7 270 bottom
R5  51.44,7.62 0 bottom
R6  102.23,7.62 0 bottom
R7  153.03,7.62 0 bottom
R8  203.84,7.62 0 bottom
R9  7.62,178.44 90 bottom
R10  7.62,127.64 90 bottom
R11  7.62,76.83 90 bottom
R12  7.62,26.04 90 bottom
RED_10  220.98,191.77 270 top
RED_32  220.98,140.97 270 top
RED_54  220.98,90.17 270 top
RED_76  220.98,39.37 270 top
SV1  153.67,224.79 180 top
SV2  105.41,224.79 180 top
U$1  114.3,115.57 0 top

### Tracks (layer width: path | path; a pad name or v marks a point on that pad's centre or on a via)
BLANK  (via drill 0.6, 0.6 pad 1.02)
  Top 0.305: v7.62,186.06 v7.62,135.25 v7.62,85.09 v7.62,34.29 v7.62,16.51 | v22.23,7.62 v43.18,7.62 v93.98,7.62 v144.78,7.62 v195.58,7.62 v213.36,7.62 | v220.98,22.86 v220.98,44.45 v220.98,95.25 v220.98,146.05 v220.98,196.85 v220.98,217.17
  Bottom 0.61: BLU_10.21 5.08,185.42 5.71,186.06 v7.62,186.06 | BLU_32.21 5.08,134.62 5.71,135.25 v7.62,135.25 | BLU_76.21 5.08,33.02 6.35,34.29 v7.62,34.29 | BLU_54.21 5.08,83.82 6.35,85.09 v7.62,85.09 | v43.18,7.62 43.18,6.35 44.45,5.08 GREEN_10.21 | v22.23,7.62 11.43,7.62 7.62,11.43 v7.62,16.51 | GREEN_32.21 95.25,5.08 93.98,6.35 v93.98,7.62 | GREEN_54.21 146.05,5.08 144.78,6.35 v144.78,7.62 | GREEN_76.21 196.85,5.08 195.58,6.35 v195.58,7.62 | v213.36,7.62 215.26,7.62 220.98,13.34 v220.98,22.86 | v220.98,44.45 222.25,44.45 223.52,45.72 RED_76.21 | RED_54.21 223.52,96.52 222.25,95.25 v220.98,95.25 | RED_32.21 223.52,147.32 222.25,146.05 v220.98,146.05 | RED_10.21 223.52,198.12 222.25,196.85 v220.98,196.85 | SV1.4 160.02,222.25 163.19,219.07 219.07,219.07 v220.98,217.17
BLU_00  (1 unrouted)
BLU_01  (1 unrouted)
BLU_02  (1 unrouted)
BLU_03  (1 unrouted)
BLU_04  (1 unrouted)
BLU_05  (1 unrouted)
BLU_06  (1 unrouted)
BLU_07  (1 unrouted)
BLU_10  (1 unrouted)
BLU_11  (1 unrouted)
BLU_12  (1 unrouted)
BLU_13  (1 unrouted)
BLU_14  (1 unrouted)
BLU_15  (1 unrouted)
BLU_16  (1 unrouted)
BLU_17  (1 unrouted)
BLU_20  (1 unrouted)
BLU_21  (1 unrouted)
BLU_22  (1 unrouted)
BLU_23  (1 unrouted)
BLU_24  (1 unrouted)
BLU_25  (1 unrouted)
BLU_26  (1 unrouted)
BLU_27  (1 unrouted)
BLU_30  (1 unrouted)
BLU_31  (1 unrouted)
BLU_32  (1 unrouted)
BLU_32_DATA  (via drill 0.6 pad 1.02)
  Top 0.305: v14.61,176.53 v14.61,129.54
  Bottom 0.61: BLU_10.22 6.35,182.88 7.62,181.61 16.51,181.61 16.51,176.53 v14.61,176.53 | v14.61,129.54 BLU_32.2
BLU_33  (1 unrouted)
BLU_34  (1 unrouted)
BLU_35  (1 unrouted)
BLU_36  (1 unrouted)
BLU_37  (1 unrouted)
BLU_40  (1 unrouted)
BLU_41  (1 unrouted)
BLU_42  (1 unrouted)
BLU_43  (1 unrouted)
BLU_44  (1 unrouted)
BLU_45  (1 unrouted)
BLU_46  (1 unrouted)
BLU_47  (1 unrouted)
BLU_50  (1 unrouted)
BLU_51  (1 unrouted)
BLU_52  (1 unrouted)
BLU_53  (1 unrouted)
BLU_54  (1 unrouted)
BLU_54_DATA  (via drill 0.6 pad 1.02)
  Top 0.305: v14.61,125.09 v14.61,78.74
  Bottom 0.61: BLU_32.22 6.35,132.08 7.62,130.81 16.51,130.81 16.51,125.09 v14.61,125.09 | v14.61,78.74 BLU_54.2
BLU_55  (1 unrouted)
BLU_56  (1 unrouted)
BLU_57  (1 unrouted)
BLU_60  (1 unrouted)
BLU_61  (1 unrouted)
BLU_62  (1 unrouted)
BLU_63  (1 unrouted)
BLU_64  (1 unrouted)
BLU_65  (1 unrouted)
BLU_66  (1 unrouted)
BLU_67  (1 unrouted)
BLU_70  (1 unrouted)
BLU_71  (1 unrouted)
BLU_72  (1 unrouted)
BLU_73  (1 unrouted)
BLU_74  (1 unrouted)
BLU_75  (1 unrouted)
BLU_76  (1 unrouted)
BLU_76_DATA  (via drill 0.6 pad 1.02)
  Top 0.305: v14.61,74.93 v14.61,27.94
  Bottom 0.61: BLU_54.22 6.35,81.28 7.62,80.01 16.51,80.01 16.51,74.93 v14.61,74.93 | v14.61,27.94 BLU_76.2
BLU_77  (1 unrouted)
BLU_IN  (via drill 0.6 pad 1.02)
  Top 0.305: v14.61,211.46 v14.61,180.34
  Bottom 0.61: v14.61,180.34 BLU_10.2 | SV1.6 154.94,222.25 149.86,217.17 17.78,217.17 14.61,214 v14.61,211.46
BLU_OUT  (via drill 0.6 pad 1.02)
  Top 0.305: v14.61,25.4 v14.61,21.59 | v21.59,13.97 v49.53,13.97
  Bottom 0.61: BLU_76.22 6.35,30.48 7.62,29.21 16.51,29.21 16.51,25.4 v14.61,25.4 | v14.61,21.59 14.61,18.41 17.78,13.97 v21.59,13.97 | v49.53,13.97 GREEN_10.2
CLOCK  (via drill 0.6, 0.6 pad 1.02)
  Top 0.305: v8.89,182.88 v8.89,132.08 v8.89,81.28 v8.89,30.48 v8.89,15.24 | v20.95,8.89 v46.99,8.89 v97.79,8.89 v148.59,8.89 v199.39,8.89 v214.63,8.89 | v219.71,21.59 v219.71,48.26 v219.71,99.06 v219.71,149.86 v219.71,200.66 v219.71,215.9
  Bottom 0.61: BLU_10.3 v8.89,182.88 | BLU_32.3 v8.89,132.08 | BLU_54.3 v8.89,81.28 | BLU_76.3 v8.89,30.48 | v46.99,8.89 GREEN_10.3 | v20.95,8.89 12.06,8.89 8.89,12.06 v8.89,15.24 | GREEN_32.3 v97.79,8.89 | GREEN_54.3 v148.59,8.89 | GREEN_76.3 v199.39,8.89 | RED_76.3 v219.71,48.26 | v219.71,21.59 219.71,13.97 v214.63,8.89 | RED_54.3 v219.71,99.06 | RED_32.3 v219.71,149.86 | RED_10.3 v219.71,200.66 | SV1.5 157.48,222.25 161.93,217.81 217.81,217.81 v219.71,215.9
GND
  Bottom 0.61: C1.2 R9.1 10.64,177.01 BLU_10.1 11.43,173.99 19.68,173.99 19.68,123.19 | C2.2 R10.1 10.64,126.21 BLU_32.1 11.43,123.19 19.68,123.19 | C3.2 R11.1 10.64,75.41 BLU_54.1 11.43,73.03 19.68,73.03 | C10.2 R12.1 10.64,24.61 BLU_76.1 11.43,22.86 19.68,22.86 | 19.68,123.19 19.68,73.03 | 19.68,73.03 19.68,22.86 | 19.68,22.86 19.68,20.32 54.61,20.32 | 54.61,20.32 54.61,11.43 GREEN_10.1 52.86,10.64 R5.1 C9.2 | C8.2 R6.1 103.66,10.64 GREEN_32.1 106.68,11.43 106.68,20.32 | 54.61,20.32 106.68,20.32 | 106.68,20.32 157.48,20.32 | 157.48,20.32 157.48,11.43 GREEN_54.1 154.46,10.64 R7.1 C7.2 | C6.2 R8.1 205.26,10.64 GREEN_76.1 208.91,11.43 208.91,20.32 | 157.48,20.32 208.91,20.32 | 208.91,20.32 208.91,59.05 | 208.91,59.05 208.91,109.86 | 208.91,109.86 208.91,161.29 | 208.91,161.29 208.91,205.74 RED_10.1 | 208.91,59.05 217.17,59.05 RED_76.1 217.96,54.13 R4.1 C5.2 | R3.1 217.96,104.93 RED_54.1 217.17,109.86 208.91,109.86 | R3.1 220.98,105.41 | C4.2 R3.1 | C11.2 R2.1 217.96,155.73 RED_32.1 217.17,161.29 208.91,161.29 | R1.1 C12.2 220.98,206.38 217.81,206.38 RED_10.1 | SV1.1 217.81,224.79 224.79,217.81 224.79,215.9 223.52,214.63 218.44,214.63 217.17,213.36 RED_10.1
  Bottom 0.813: SV1.2 SV1.1
GRN_00  (1 unrouted)
  Bottom 0.305: 41.91,12.7 GREEN_10.5
GRN_01  (1 unrouted)
GRN_02  (1 unrouted)
GRN_03  (1 unrouted)
GRN_04  (1 unrouted)
GRN_05  (1 unrouted)
GRN_06  (1 unrouted)
GRN_07  (1 unrouted)
GRN_10  (1 unrouted)
GRN_11  (1 unrouted)
GRN_12  (1 unrouted)
GRN_13  (1 unrouted)
GRN_14  (1 unrouted)
GRN_15  (1 unrouted)
GRN_16  (1 unrouted)
GRN_17  (1 unrouted)
GRN_20  (1 unrouted)
GRN_21  (1 unrouted)
GRN_22  (1 unrouted)
GRN_23  (1 unrouted)
GRN_24  (1 unrouted)
GRN_25  (2 unrouted)
  Bottom 0.305: 81.28,13.97 80.01,13.97
GRN_26  (1 unrouted)
GRN_27  (1 unrouted)
GRN_30  (1 unrouted)
GRN_31  (1 unrouted)
GRN_32  (1 unrouted)
GRN_32_DATA  (via drill 0.6 pad 1.02)
  Top 0.305: v52.07,13.97 v100.33,13.97
  Bottom 0.61: GREEN_10.22 46.99,5.08 48.26,6.35 48.26,15.24 52.07,15.24 v52.07,13.97 | v100.33,13.97 GREEN_32.2
GRN_33  (1 unrouted)
GRN_34  (1 unrouted)
GRN_35  (1 unrouted)
GRN_36  (1 unrouted)
GRN_37  (1 unrouted)
GRN_40  (1 unrouted)
GRN_41  (1 unrouted)
GRN_42  (1 unrouted)
GRN_43  (1 unrouted)
GRN_44  (1 unrouted)
GRN_45  (1 unrouted)
GRN_46  (1 unrouted)
GRN_47  (1 unrouted)
GRN_50  (1 unrouted)
GRN_51  (1 unrouted)
GRN_52  (1 unrouted)
GRN_53  (1 unrouted)
GRN_54  (1 unrouted)
GRN_54_DATA  (via drill 0.6 pad 1.02)
  Top 0.305: v102.87,13.97 v151.13,13.97
  Bottom 0.61: GREEN_32.22 97.79,5.08 99.06,6.35 99.06,15.24 102.87,15.24 v102.87,13.97 | v151.13,13.97 GREEN_54.2
GRN_55  (1 unrouted)
GRN_56  (1 unrouted)
GRN_57  (1 unrouted)
GRN_60  (1 unrouted)
GRN_61  (1 unrouted)
GRN_62  (1 unrouted)
GRN_63  (1 unrouted)
GRN_64  (1 unrouted)
GRN_65  (1 unrouted)
GRN_66  (1 unrouted)
GRN_67  (1 unrouted)
  Bottom 0.305: 203.2,43.18 U$1.GRN_67
GRN_70  (1 unrouted)
GRN_71  (1 unrouted)
GRN_72  (1 unrouted)
GRN_73  (1 unrouted)
GRN_74  (1 unrouted)
GRN_75  (1 unrouted)
GRN_76  (1 unrouted)
GRN_76_DATA  (via drill 0.6 pad 1.02)
  Top 0.305: v153.67,13.97 v201.93,13.97
  Bottom 0.61: GREEN_54.22 148.59,5.08 149.86,6.35 149.86,15.24 153.67,15.24 v153.67,13.97 | v201.93,13.97 GREEN_76.2
GRN_77  (1 unrouted)
  Bottom 0.305: 203.2,16.51 U$1.GRN_77
GRN_OUT  (via drill 0.6 pad 1.02)
  Top 0.305: v211.46,203.2 v207.65,203.2 | v207.65,21.59 v207.65,18.41
  Bottom 0.61: RED_10.2 v211.46,203.2 | v207.65,203.2 v207.65,21.59 | v207.65,18.41 204.47,15.24 200.66,15.24 200.66,6.35 199.39,5.08 GREEN_76.22
LATCH  (via drill 0.6, 0.6 pad 1.02)
  Top 0.305: v6.35,184.15 v6.35,133.35 v6.35,82.55 v6.35,31.75 v6.35,15.24 | v20.95,6.35 v45.72,6.35 v96.52,6.35 v147.32,6.35 v198.12,6.35 v214.63,6.35 | v222.25,21.59 v222.25,46.99 v222.25,97.79 v222.25,148.59 v222.25,199.39 v222.25,215.9
  Bottom 0.61: BLU_10.4 10.16,185.42 8.89,184.15 v6.35,184.15 | v6.35,133.35 8.89,133.35 10.16,134.62 BLU_32.4 | v6.35,31.75 8.26,31.75 9.53,33.02 BLU_76.4 | v6.35,82.55 8.89,82.55 10.16,83.82 BLU_54.4 | GREEN_10.4 44.45,8.89 45.72,7.62 v45.72,6.35 | v20.95,6.35 10.79,6.35 6.35,10.79 v6.35,15.24 | GREEN_32.4 95.25,8.89 96.52,7.62 v96.52,6.35 | GREEN_54.4 146.05,9.53 147.32,8.26 v147.32,6.35 | GREEN_76.4 196.85,8.89 198.12,7.62 v198.12,6.35 | RED_76.4 219.71,45.72 220.98,46.99 v222.25,46.99 | v222.25,21.59 222.25,12.7 215.9,6.35 v214.63,6.35 | RED_54.4 219.71,96.52 220.98,97.79 v222.25,97.79 | RED_32.4 219.71,147.32 220.98,148.59 v222.25,148.59 | RED_10.4 219.71,198.12 220.98,199.39 v222.25,199.39 | SV1.3 162.56,222.25 164.47,220.34 219.71,220.34 222.25,217.81 v222.25,215.9
N$1
  Bottom 0.61: R5.2 49.53,7.62 GREEN_10.23
N$3
  Bottom 0.61: R6.2 100.81,7.47 100.33,6.99 GREEN_32.23
N$4
  Bottom 0.61: GREEN_54.23 151.13,7.14 R7.2
N$5
  Bottom 0.61: R8.2 202.41,6.83 201.93,6.35 GREEN_76.23
N$6
  Bottom 0.61: BLU_10.23 7.14,180.34 R9.2
N$7
  Bottom 0.61: R10.2 7.14,129.54 BLU_32.23
N$8
  Bottom 0.61: R11.2 7.62,78.11 6.99,78.74 BLU_54.23
N$9
  Bottom 0.61: R12.2 7.47,27.46 6.99,27.94 BLU_76.23
N$13
  Bottom 0.61: R1.2 221.13,203.68 221.62,203.2 RED_10.23
N$14
  Bottom 0.61: R2.2 221.13,152.88 221.62,152.4 RED_32.23
N$15
  Bottom 0.61: R3.2 221.13,102.08 221.62,101.6 RED_54.23
N$18
  Bottom 0.61: R4.2 221.13,51.28 221.62,50.8 RED_76.23
RED_00  (1 unrouted)
RED_01  (1 unrouted)
RED_02  (1 unrouted)
RED_03  (1 unrouted)
RED_04  (1 unrouted)
RED_05  (1 unrouted)
RED_06  (1 unrouted)
RED_07  (1 unrouted)
RED_10  (1 unrouted)
RED_11  (1 unrouted)
RED_12  (1 unrouted)
RED_13  (1 unrouted)
RED_14  (1 unrouted)
RED_15  (1 unrouted)
RED_16  (1 unrouted)
RED_17  (1 unrouted)
RED_20  (1 unrouted)
RED_21  (1 unrouted)
RED_22  (1 unrouted)
RED_23  (1 unrouted)
RED_24  (1 unrouted)
RED_25  (1 unrouted)
RED_26  (1 unrouted)
RED_27  (1 unrouted)
RED_30  (1 unrouted)
RED_31  (1 unrouted)
RED_32  (1 unrouted)
RED_32_DATA  (via drill 0.6 pad 1.02)
  Top 0.305: v214.63,200.03 v214.63,159.38
  Bottom 0.61: RED_10.22 222.88,200.66 221.62,201.93 214.63,201.93 v214.63,200.03 | v214.63,159.38 214.63,152.4 RED_32.2
RED_33  (1 unrouted)
RED_34  (1 unrouted)
RED_35  (1 unrouted)
RED_36  (1 unrouted)
RED_37  (1 unrouted)
RED_40  (1 unrouted)
RED_41  (1 unrouted)
RED_42  (1 unrouted)
RED_43  (1 unrouted)
RED_44  (1 unrouted)
RED_45  (1 unrouted)
RED_46  (1 unrouted)
RED_47  (1 unrouted)
RED_50  (1 unrouted)
RED_51  (1 unrouted)
RED_52  (1 unrouted)
RED_53  (1 unrouted)
RED_54  (1 unrouted)
RED_54_DATA  (via drill 0.6 pad 1.02)
  Top 0.305: v214.63,149.86 v214.63,107.95
  Bottom 0.61: RED_32.22 223.52,149.86 222.25,151.13 214.63,151.13 v214.63,149.86 | v214.63,107.95 214.63,101.6 RED_54.2
RED_55  (1 unrouted)
RED_56  (1 unrouted)
RED_57  (1 unrouted)
RED_60  (1 unrouted)
RED_61  (1 unrouted)
RED_62  (1 unrouted)
RED_63  (1 unrouted)
RED_64  (1 unrouted)
RED_65  (1 unrouted)
RED_66  (1 unrouted)
RED_67  (1 unrouted)
RED_70  (1 unrouted)
RED_71  (1 unrouted)
RED_72  (1 unrouted)
RED_73  (1 unrouted)
RED_74  (1 unrouted)
RED_75  (1 unrouted)
RED_76  (1 unrouted)
RED_76_DATA  (via drill 0.6 pad 1.02)
  Top 0.305: v214.63,97.79 v214.63,57.15
  Bottom 0.61: RED_54.22 223.52,99.06 222.25,100.33 214.63,100.33 v214.63,97.79 | v214.63,57.15 214.63,50.8 RED_76.2
RED_77  (1 unrouted)
VCC
  Bottom 0.61: C1.1 5.21,171.32 3.81,172.72 BLU_10.24 1.27,177.8 | C2.1 5.21,120.52 3.81,121.92 BLU_32.24 1.27,127 | C3.1 5.21,69.72 3.81,71.12 BLU_54.24 1.27,76.2 | C10.1 5.21,18.92 5.08,19.05 | 5.08,19.05 3.81,20.32 BLU_76.24 1.27,25.4 | 5.71,19.05 5.08,19.05 | 1.27,177.8 1.27,127 | 1.27,127 1.27,76.2 | 1.27,76.2 1.27,25.4 | 1.27,25.4 1.27,11.43 11.43,1.27 52.07,1.27 | 52.07,1.27 GREEN_10.24 57.15,3.81 58.55,5.21 C9.1 | C8.1 109.35,5.21 107.95,3.81 GREEN_32.24 102.87,1.27 | 52.07,1.27 102.87,1.27 | C7.1 160.15,4.58 159.38,3.81 GREEN_54.24 153.67,1.27 | 102.87,1.27 153.67,1.27 | 153.67,1.27 204.47,1.27 | 204.47,1.27 GREEN_76.24 209.55,3.81 210.95,5.21 C6.1 | 204.47,1.27 217.81,1.27 227.33,10.79 227.33,53.34 | 227.33,53.34 227.33,104.14 | 227.33,104.14 227.33,154.94 | 227.33,154.94 227.33,205.74 RED_10.24 224.79,211.46 224.03,212.22 C12.1 | 227.33,154.94 RED_32.24 224.79,160.66 224.03,161.42 C11.1 | 227.33,104.14 RED_54.24 224.79,109.22 223.39,110.62 C4.1 | 227.33,53.34 RED_76.24 224.79,58.42 223.39,59.82 C5.1 | SV1.12 139.7,222.25 135.89,218.44 6.35,218.44 1.27,213.36 1.27,177.8

### Text on the board
Bottom: 8x8 LED Cathode Board V4